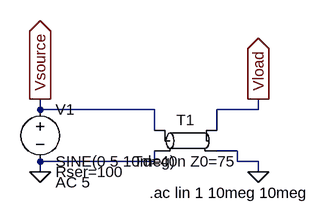
[diagram p0: schematic no load.asc]
no load.asc, the LTspice schematic file:
Version 4
SHEET 1 880 680
WIRE 0 112 0 96
WIRE 176 112 0 112
WIRE 336 112 336 96
WIRE 336 112 272 112
WIRE 176 144 176 112
WIRE 272 144 272 112
WIRE 304 176 272 176
WIRE 176 192 176 176
WIRE 176 192 0 192
WIRE 304 192 304 176
WIRE 336 192 304 192
WIRE 0 208 0 192
WIRE 336 208 336 192
FLAG 0 208 0
FLAG 0 96 Vsource
IOPIN 0 96 Out
FLAG 336 208 0
FLAG 336 96 Vload
IOPIN 336 96 Out
SYMBOL tline 224 160 R0
SYMATTR InstName T1
SYMATTR Value Td=40n Z0=75
SYMBOL voltage 0 96 R0
WINDOW 123 24 128 Left 2
WINDOW 39 24 112 Left 2
SYMATTR InstName V1
SYMATTR Value SINE(0 5 10meg)
SYMATTR Value2 AC 5
SYMATTR SpiceLine Rser=100
TEXT 168 240 Left 2 !.ac lin 1 10meg 10meg

The netlist it stands for:
* no load.asc
T1 Vsource 0 Vload 0 Td=40n Z0=75
V1 Vsource 0 SINE(0 5 10meg) AC 5 Rser=100
.ac lin 1 10meg 10meg
.backanno
.end